# EAGLE design openSX70_EDWIN_V7-9_20191123-TSL237T (EAGLE 9.4.2)
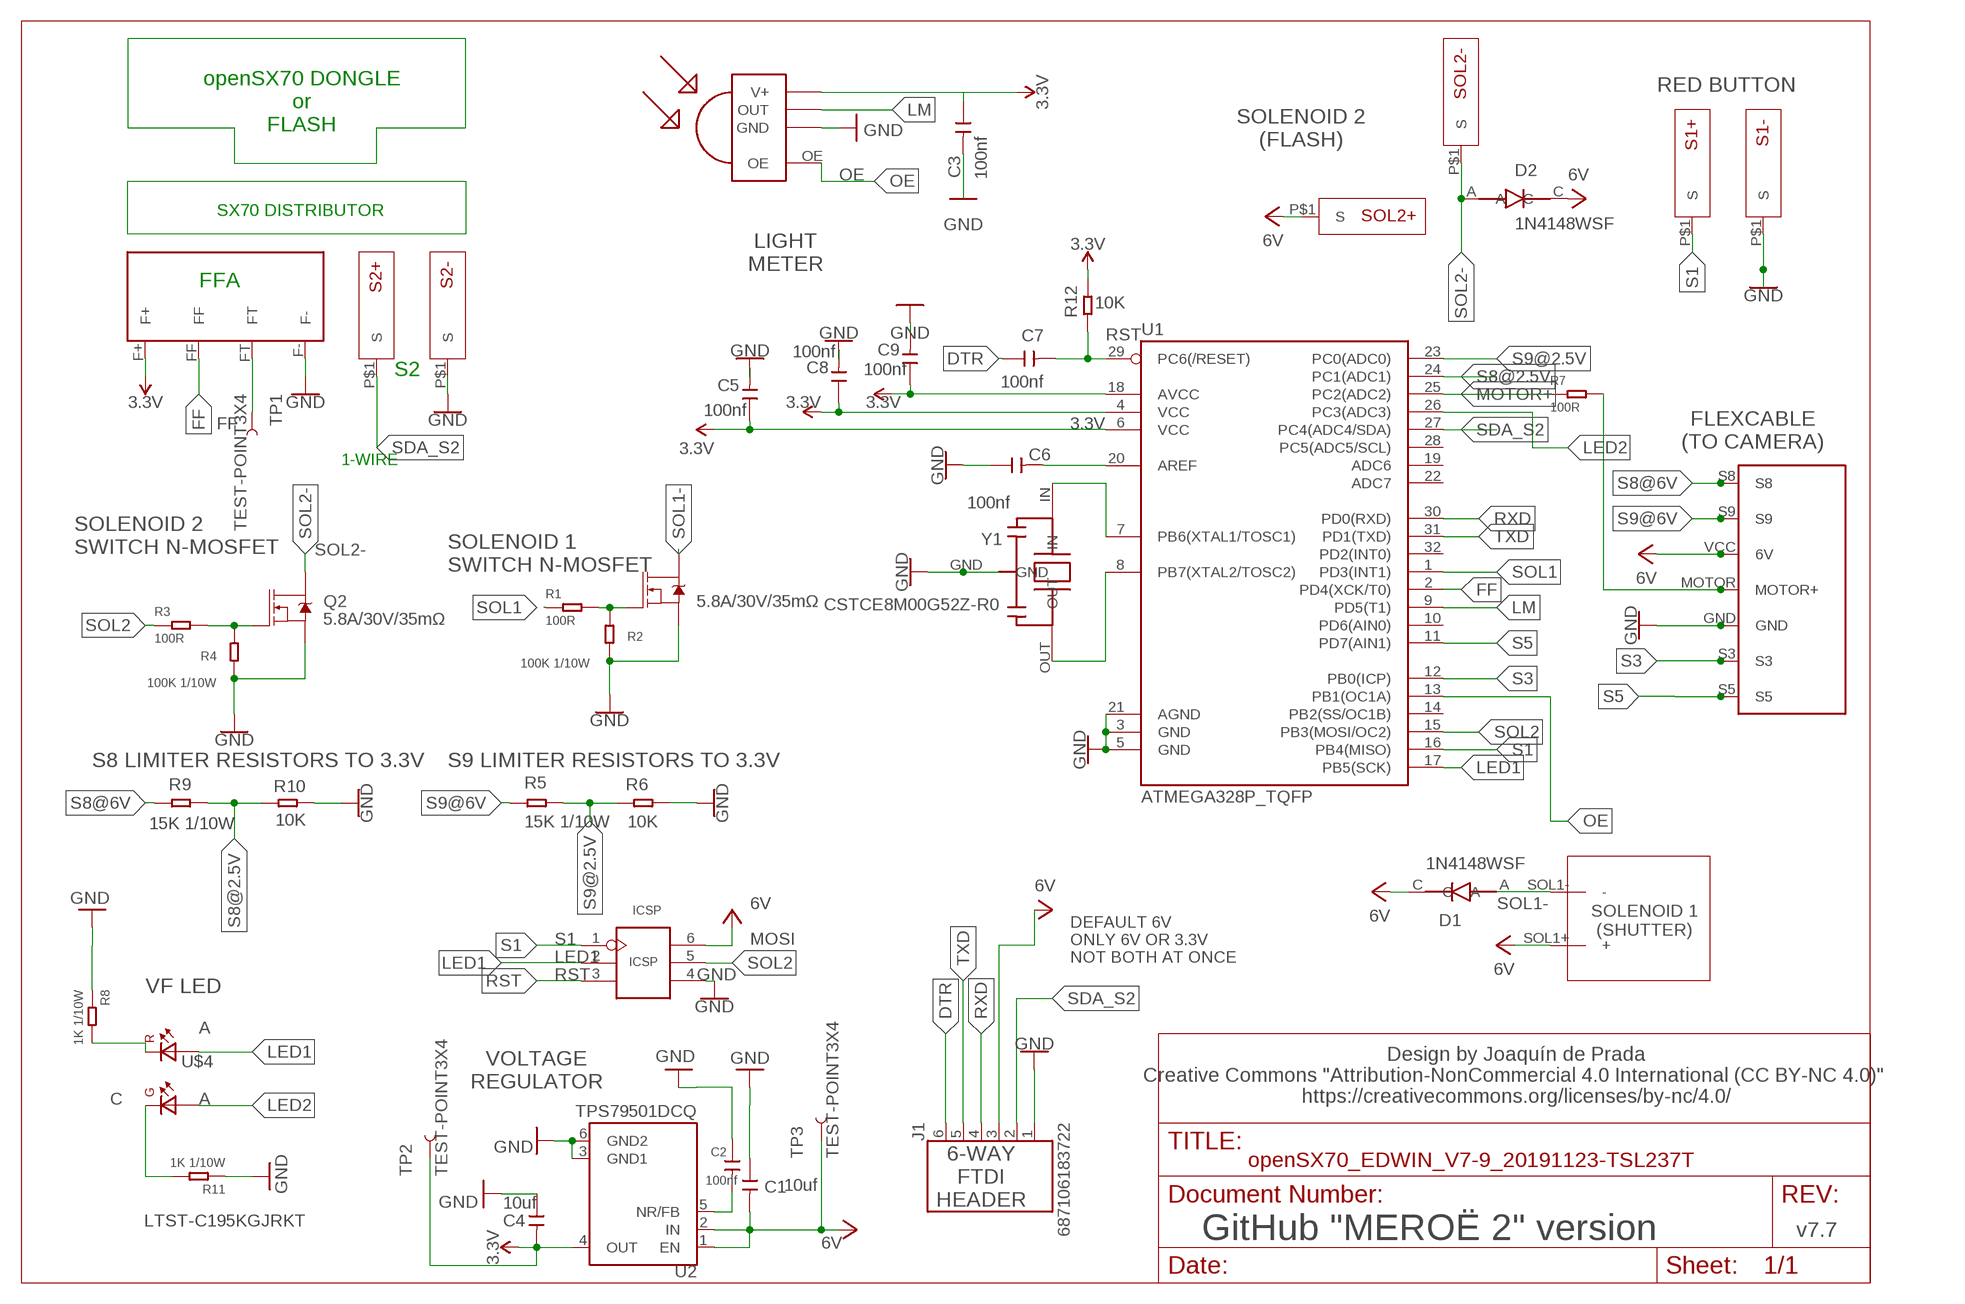
[diagram p0: schematic, sheet 1]

## Parts
C1  10uf  CERAMIC-10UF-10V-10%-X5R(0603)  [C0603]
C2  100nf  CERAMIC-100NF-50V-10%-X7R(0603)  [C0603]
C3  100nf  CERAMIC-100NF-50V-10%-X7R(0603)  [C0603]
C4  10uf  CERAMIC-10UF-10V-10%-X5R(0603)  [C0603]
C5  100nf  CERAMIC-100NF-50V-10%-X7R(0603)  [C0603]
C6  100nf  CERAMIC-100NF-50V-10%-X7R(0603)  [C0603]
C7  100nf  CERAMIC-100NF-50V-10%-X7R(0603)  [C0603]
C8  100nf  CERAMIC-100NF-50V-10%-X7R(0603)  [C0603]
C9  100nf  CERAMIC-100NF-50V-10%-X7R(0603)  [C0603]
D1  1N4148WSF  1N4148WS  [SODFL2512X100N]
D2  1N4148WSF  1N4148WS  [SODFL2512X100N]
ICSP  ICSP  [H2X3-2.54]
J1  687106183722  [687106183722]
Q1  5.8A/30V/35mΩ  MOSFET-NCH-AO3404A  [SOT23-3]
Q2  5.8A/30V/35mΩ  MOSFET-NCH-AO3404A  [SOT23-3]
R1  100R  SMD-RES-100R-5%-1/10W(0603)  [R0603]
R2  100K 1/10W  SMD-RES-100K-5%-1/10W(0603)  [R0603]
R3  100R  SMD-RES-100R-5%-1/10W(0603)  [R0603]
R4  100K 1/10W  SMD-RES-100K-5%-1/10W(0603)  [R0603]
R5  15K 1/10W  SMD-RES-15K-1%-1/10W(0603)  [R0603]
R6  10K  SMD-RES-10K-1%-1/10W(0603)  [R0603]
R7  100R  SMD-RES-100R-5%-1/10W(0603)  [R0603]
R8  1K 1/10W  SMD-RES-1K-5%-1/10W(0603)  [R0603]
R9  15K 1/10W  SMD-RES-15K-1%-1/10W(0603)  [R0603]
R10  10K  SMD-RES-10K-1%-1/10W(0603)  [R0603]
R11  1K 1/10W  SMD-RES-1K-5%-1/10W(0603)  [R0603]
R12  10K  SMD-RES-10K-1%-1/10W(0603)  [R0603]
S1+  SX70-S-PAD-NEW  [SX70-S-PAD2]
S1-  SX70-S-PAD-NEW  [SX70-S-PAD2]
S2+  SX70-S-PAD-NEW  [SX70-S-PAD2]
S2-  SX70-S-PAD-NEW  [SX70-S-PAD2]
SOL1  SX70-SOLENOID1-2PADS  [SX70-SOLENOID1-2]
SOL2+  SX70-S-PAD-NEW  [SX70-S-PAD2]
SOL2-  SX70-S-PAD-NEW  [SX70-S-PAD2]
TP1  TEST-POINT3X4  [PAD.03X.04]
TP2  TEST-POINT3X4  [PAD.03X.04]
TP3  TEST-POINT3X4  [PAD.03X.04]
U1  ATMEGA328P_TQFP  [TQFP32-08]
U2  TPS79501DCQ  [SOT127P706X180-6N]
U$1  SX70-7-PAD  [SX70-7-PAD-PROPER]
U$2  FFA  SX70-FFA-PAD  [FFA-PAD-PACKAGE]
U$3  TSL237T  [TSL237T]
U$4  LTST-C195KGJRKT  [LTST-BILED-15X16]
Y1  CSTCE8M00G52Z-R0  CSTCE16M0V53-R0  [CFP95P160X100-3N]

## Nets
3.3V: C3.1 C4.2 C5.1 C8.1 C9.1 R12.2 TP2.P$1 U1.4(VCC) U1.6(VCC) U1.18(AVCC) U2.4(OUT) U$2.F+ U$3.VDD(V+)
6V: C1.2 D1.C D2.C ICSP.6(VCC) J1.3 SOL1.SOL1+(+) SOL2+.P$1(S) TP3.P$1 U2.1(EN) U2.2(IN) U$1.VCC(6V)
DTR: C7.1 J1.6
FF: U1.2(PD4(XCK/T0)) U$2.FF
GND: C1.1 C2.1 C3.2 C4.1 C5.2 C6.1 C8.2 C9.2 ICSP.4(GND) J1.1 Q1.2(S) Q2.2(S) R2.1 R4.1 R6.2 R8.1 R10.2 R11.1 S1-.P$1(S) S2-.P$1(S) U1.3(GND) U1.5(GND) U1.21(AGND) U2.3(GND1) U2.6(GND2) U$1.GND U$2.F- U$3.GND Y1.GND
LED1: ICSP.2(SCK) U1.17(PB5(SCK)) U$4.P$2(A2)
LED2: U1.26(PC3(ADC3)) U$4.P$1(A1)
LM: U1.9(PD5(T1)) U$3.OUT
MOTOR+: R7.1 U1.25(PC2(ADC2))
MOTOR-HEADER: R7.2 U$1.MOTOR(MOTOR+)
N$1: Q1.1(G) R1.2 R2.2
N$2: C6.2 U1.20(AREF)
N$3: Q2.1(G) R3.2 R4.2
N$4: U1.7(PB6(XTAL1/TOSC1)) Y1.IN
N$5: TP1.P$1 U$2.FT
N$6: U1.8(PB7(XTAL2/TOSC2)) Y1.OUT
N$7: R8.2 U$4.P$4(K2)
N$10: C2.2 U2.5(NR/FB)
N$11: R11.2 U$4.P$3(K1)
OE: U1.13(PB1(OC1A)) U$3.OE
RST: C7.2 ICSP.3(RST) R12.1 U1.29(PC6(/RESET))
RXD: J1.4 U1.30(PD0(RXD))
S1: ICSP.1(MISO) S1+.P$1(S) U1.16(PB4(MISO))
S3: U1.12(PB0(ICP)) U$1.S3
S5: U1.11(PD7(AIN1)) U$1.S5
S8@2.5V: R9.2 R10.1 U1.24(PC1(ADC1))
S8@6V: R9.1 U$1.S8
S9@2.5V: R5.2 R6.1 U1.23(PC0(ADC0))
S9@6V: R5.1 U$1.S9
SDA_S2: J1.2 S2+.P$1(S) U1.27(PC4(ADC4/SDA))
SOL1: R1.1 U1.1(PD3(INT1))
SOL1-: D1.A Q1.3(D) SOL1.SOL1-(-)
SOL2: ICSP.5(MOSI) R3.1 U1.15(PB3(MOSI/OC2))
SOL2-: D2.A Q2.3(D) SOL2-.P$1(S)
TXD: J1.5 U1.31(PD1(TXD))
Unconnected: U1.10(PD6(AIN0)) U1.14(PB2(SS/OC1B)) U1.19(ADC6) U1.22(ADC7) U1.28(PC5(ADC5/SCL)) U1.32(PD2(INT0))

## Notes on the sheet
- RED BUTTON
- openSX70 DONGLE
  or
  FLASH
- SOLENOID 2
  (FLASH)
- SX70 DISTRIBUTOR
- LIGHT
  METER
- FFA
- S2
- FLEXCABLE
  (TO CAMERA)
- 1-WIRE
- SOLENOID 2
  SWITCH N-MOSFET
- SOLENOID 1
  SWITCH N-MOSFET
- S8 LIMITER RESISTORS TO 3.3V | S9 LIMITER RESISTORS TO 3.3V
- SOLENOID 1
  (SHUTTER)
- MOSI
- DEFAULT 6V
  ONLY 6V OR 3.3V
  NOT BOTH AT ONCE
- VF LED
- A
- VOLTAGE
  REGULATOR
- Design by Joaquín de Prada
  Creative Commons "Attribution-NonCommercial 4.0 International (CC BY-NC 4.0)" 
  https://creativecommons.org/licenses/by-nc/4.0/
- C | A
- 6-WAY
  FTDI
  HEADER
- v7.7
- GitHub "MEROË 2" version

## Library data of the parts
C1 C4 = Seeed-Capacitor:CERAMIC-10UF-10V-10%-X5R(0603): 302010103; MPN: CC0603KRX5R6BB106
C2 C3 C5-C9 = Seeed-Capacitor:CERAMIC-100NF-50V-10%-X7R(0603): 302010138; MPN: CC0603KRX7R9BB104
D1 D2 = Common-Parts-Library-Eagle:1N4148WS: 1N4148WS Series 75 V 300 mA Surface Mount Small Signal Diodes - SOD-323F; MANUFACTURER: Fairchild Semiconductor
ICSP = openSX70:ICSP
J1 = 687106183722:687106183722: 687106183722 WR-FPC 0.50mm SMT Horizontal Bottom Contact - Low Profile <http://katalog.we-online.de/media/images/v2/Family_WR-FPC_6871xx183722.jpg> Details see: http://katalog.we-online.de/en/em/FPC_0_5_SMT_ZIF_HORIZONTAL_BOTTOM_CONTACT_LOW_PROFILE_6871xx183722 Created by Yingchun,shan 2016 (C) Wurth Elektronik; AVAILABILITY: Good; DESCRIPTION: CONN FFC BTM 6POS 0.5MM SMD R/A; MF: Wurth Electronics; MP: 687106183722; PACKAGE: None; PRICE: 1.21 USD
Q1 Q2 = openSX70:MOSFET-NCH: N-channel MOSFETs Voltage controlled devices that allow control of high current outputs. SparkFun Products: SparkFun OpenScale <https://www.sparkfun.com/products/13261> SparkFun Digital Sandbox <https://www.sparkfun.com/products/12651> SparkFun Monster Moto Shield <https://www.sparkfun.com/products/10182> SparkFun MOSFET Power Controller <https://www.sparkfun.com/products/11214>; PROD_ID: TRANS-12988
R1 R3 R7 = Seeed-Resistor:SMD-RES-100R-5%-1/10W(0603): 301010090; MPN: RC0603JR-07100RL
R2 R4 = Seeed-Resistor:SMD-RES-100K-5%-1/10W(0603): 301010089; MPN: RC0603JR-07100KL
R5 R9 = Seeed-Resistor:SMD-RES-15K-1%-1/10W(0603): 301010241; MPN: RC0603FR-0715KL
R6 R10 R12 = Seeed-Resistor:SMD-RES-10K-1%-1/10W(0603): 301010299; MPN: RC0603FR-0710KL
R8 R11 = Seeed-Resistor:SMD-RES-1K-5%-1/10W(0603): 301010291; MPN: RC0603JR-071KL
S1+ S1- S2+ S2- SOL2+ SOL2- = openSX70:SX70-S-PAD-NEW
SOL1 = openSX70:SX70-SOLENOID1-2PADS
TP1-TP3 = SparkFun-Connectors:TEST-POINT: SparkFun Test Points Bare copper test points for troubleshooting or In-Circuit-Testing. These are used by our Production team for verifying production board runs using pogo-pins on test beds. SparkFun Products: SparkFun LSM9DS1 Breakout <https://www.sparkfun.com/products/13284> SparkFun PSOC <https://www.sparkfun.com/products/13714> SparkFun Load Cell Amplifier <https://www.sparkfun.com/products/13879>
U1 = openSX70:ATMEGA328P_TQFP: Popular 328P in QFP Storefront component: ATmega328 - TQFP <https://www.sparkfun.com/products/13448> (COM-13448) Datasheet <http://www.sparkfun.com/datasheets/Components/SMD/ATMega328.pdf> SparkFun Products SparkFun RedBoard - Programmed with Arduino <https://www.sparkfun.com/products/12757> (DEV-12757) Arduino Pro Mini 328 - 5V/16MHz <https://www.sparkfun.com/products/11113> (DEV-11113) Arduino Pro Mini 328 - 3.3V/8MHz <https://www.sparkfun.com/products/11114> (DEV-11114) SparkFun OpenLog <https://www.sparkfun.com/products/13712> (DEV-13712) SparkFun MicroView - OLED Arduino Module <https://www.sparkfun.com/products/12923> (DEV-12923) SparkFun Digital Sandbox <https://www.sparkfun.com/products/12651> (DEV-12651) SparkFun PicoBoard <https://www.sparkfun.com/products/11888> (WIG-11888) Arduino Fio <https://www.sparkfun.com/products/10116> (DEV-10116) LilyPad Arduino 328 Main Board <https://www.sparkfun.com/products/13342> (DEV-13342) SparkFun RedStick <https://www.sparkfun.com/products/13741> (DEV-13741) LilyPad MP3 <https://www.sparkfun.com/products/11013> (DEV-11013) LilyPad Arduino SimpleSnap <https://www.sparkfun.com/products/10941> (DEV-10941) SparkFun Stepoko <https://www.sparkfun.com/products/13899> (ROB-13899) SparkFun Geiger Counter <https://www.sparkfun.com/products/11345> (SEN-11345) SparkFun EL Sequencer <https://www.sparkfun.com/products/12781> (COM-12781) Arduino Pro 328 - 5V/16MHz <https://www.sparkfun.com/products/10915> (DEV-10915) CryptoCape <https://www.sparkfun.com/products/12773> (DEV-12773) SparkFun IR Thermometer Evaluation Board - MLX90614 <https://www.sparkfun.com/products/10740> (SEN-10740) SparkFun RedBot Mainboard <https://www.sparkfun.com/products/12097> (ROB-12097) Arduino Pro 328 - 3.3V/8MHz <https://www.sparkfun.com/products/10914> (DEV-10914) SparkFun Block for Intel® Edison - Arduino <https://www.sparkfun.com/products/13036> (DEV-13036) SparkFun Simon Says - Surface Mount Soldering Kit <https://www.sparkfun.com/products/10935> (KIT-10935) SparkFun 7-Segment Serial Display - Red <https://www.sparkfun.com/products/11441> (COM-11441) SparkFun 7-Segment Serial Display - White <https://www.sparkfun.com/products/11629> (COM-11629) SparkFun 7-Segment Serial Display - Yellow <https://www.sparkfun.com/products/11443> (COM-11443) SparkFun 7-Segment Serial Display - Kelly Green <https://www.sparkfun.com/products/11440> (COM-11440) SparkFun 7-Segment Serial Display - Blue <https://www.sparkfun.com/products/11442> (COM-11442) SparkFun OpenSegment Serial Display - 20mm (Blue) <https://www.sparkfun.com/products/11647> (COM-11647) SparkFun OpenSegment Serial Display - 20mm (Green) <https://www.sparkfun.com/products/11646> (COM-11646) SparkFun OpenSegment Serial Display - 20mm (White) <https://www.sparkfun.com/products/11648> (COM-11648) SparkFun OpenSegment Serial Display - 20mm (Red) <https://www.sparkfun.com/products/11644> (COM-11644) SparkFun OpenSegment Serial Display - 20mm (Yellow) <https://www.sparkfun.com/products/11645> (COM-11645) SparkFun OpenSegment Shield <https://www.sparkfun.com/products/13190> (DEV-13190); PROD_ID: IC-09069
U2 = TPS79501DCQ:TPS79501DCQ: Ultralow-Noise, High-PSRR, Fast, RF, 500-mA Low-Dropout Linear Regulators 6-SOT-223 -40 to 125; DESCRIPTION: Ultralow-Noise, High-PSRR, Fast, RF, 500-mA Low-Dropout Linear Regulators 6-SOT-223 -40 to 125; DIGI-KEY_PART_NUMBER: 296-27102-5-ND; DIGI-KEY_PURCHASE_URL: https://www.digikey.com/product-detail/en/texas-instruments/TPS79501DCQ/296-27102-5-ND/1908443?utm_source=snapeda&utm_medium=aggregator&utm_campaign=symbol; MF: Texas Instruments; MP: TPS79501DCQ; PACKAGE: SOT-223-6 Texas Instruments
U$1 = _openSX70:SX70-7-PAD
U$2 = openSX70:SX70-FFA-PAD
U$3 = _openSX70:TSL237T
U$4 = LTST-C195KGJRKT:LTST-C195KGJRKT; AVAILABILITY: Unavailable; DESCRIPTION: Green/Red 130° Water Clear 35/25 mcd 2 V 0605 Surface Mount Bi-Color LED; MF: Lite-On Inc.; MP: LTST-C195KGJRKT; PACKAGE: 0606 Lite-On; PRICE: None
Y1 = CSTCE16M0V53-R0:CSTCE16M0V53-R0: Ceramic Resonator 16MHz ±0.5% (Tol) ±0.3% (Stability) 15pF 40Ohm 3-Pin CSMD T/R; AVAILABILITY: Good; DESCRIPTION: Ceramic Resonator 16MHz ??0.5% (Tol) ??0.3% (Stability) 15pF 40Ohm 3-Pin CSMD T/R; MF: Murata; MP: CSTCE16M0V53-R0; PACKAGE: SMD-3 Murata; PRICE: 0.28 USD

## Net classes
0 default: width 0.254 mm
1 GND: width 0.61 mm

## Board
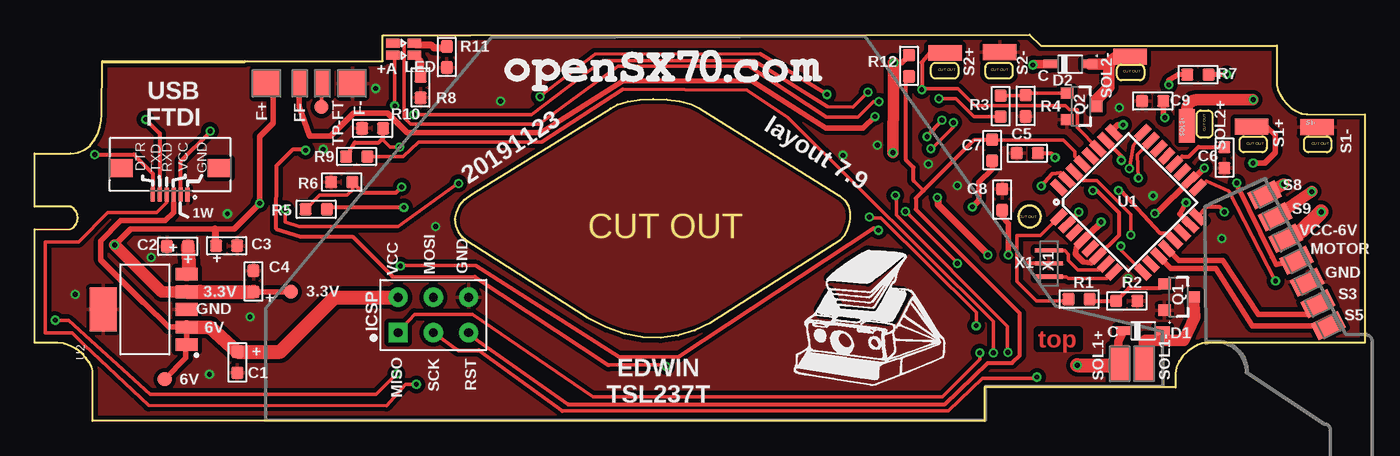
[diagram p1: board, top side]
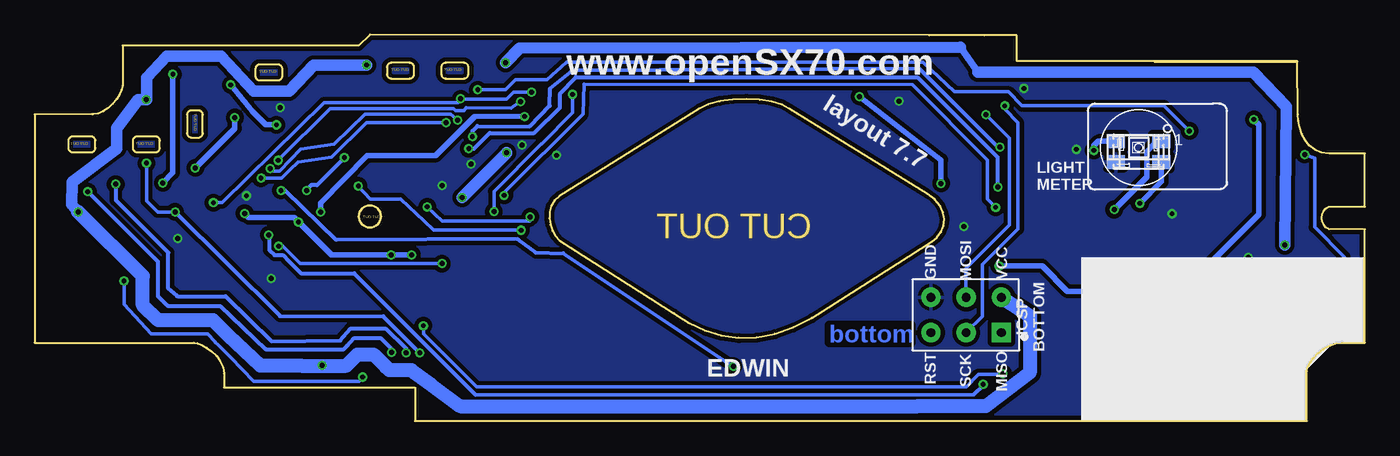
[diagram p2: board, bottom side, seen from below]

Size 95.88 x 27.86 mm. Coordinates in mm from the lower left corner, seen from the top.
Outline: 71.72,15.54 71.88,15.53 72.03,15.48 72.17,15.41 72.29,15.31
Outline: 72.29,15.31 72.39,15.19 72.46,15.06 72.51,14.91 72.52,14.74
Outline: 72.52,14.74 72.51,14.58 72.46,14.43 72.39,14.3 72.29,14.18
Outline: 72.29,14.18 72.17,14.08 72.03,14.01 71.88,13.96 71.72,13.94
Outline: 71.72,13.94 71.56,13.96 71.41,14.01 71.28,14.08 71.16,14.18
Outline: 71.16,14.18 71.06,14.3 70.99,14.43 70.94,14.58 70.92,14.74
Outline: 70.92,14.74 70.94,14.91 70.99,15.06 71.06,15.19 71.16,15.31
Outline: 71.16,15.31 71.28,15.41 71.41,15.48 71.56,15.53 71.72,15.54
Outline: 71.72,15.54 71.57,15.53 71.42,15.48 71.28,15.41 71.16,15.31
Outline: 71.16,15.31 71.06,15.19 70.98,15.05 70.94,14.9 70.92,14.74
Outline: 70.92,14.74 70.94,14.59 70.98,14.44 71.06,14.3 71.16,14.18
Outline: 71.16,14.18 71.28,14.08 71.42,14.01 71.57,13.96 71.72,13.94
Outline: 71.72,13.94 71.88,13.96 72.03,14.01 72.17,14.08 72.29,14.18
Outline: 72.29,14.18 72.39,14.3 72.46,14.44 72.51,14.59 72.52,14.74
Outline: 72.52,14.74 72.51,14.9 72.46,15.05 72.39,15.19 72.29,15.31
Outline: 72.29,15.31 72.17,15.41 72.03,15.48 71.88,15.53 71.72,15.54
Outline: 91.7,22.11 91.77,22.11 95.88,22.11 95.88,5.64 84.4,5.64 84.15,5.6 83.83,5.47 83.48,5.27 83.11,5.01 82.78,4.68 82.5,4.3 82.31,3.87 82.24,3.4 82.24,2.41 68.47,2.41 68.47,0 4.17,0 4.17,3.6 4.11,3.9 3.94,4.23 3.69,4.56 3.36,4.89 2.98,5.18 2.56,5.42 2.11,5.58 1.66,5.64 0,5.64 0,13.82 2.59,13.84 2.81,13.96 2.98,14.15 3.07,14.39 3.1,14.65 3.07,14.91 2.97,15.15 2.81,15.34 2.59,15.45 0,15.46 0,19.29 2.59,19.29 3.14,19.36 3.6,19.56 3.99,19.87 4.3,20.26 4.53,20.7 4.7,21.17 4.79,21.65 4.82,22.11 4.87,25.93 15.15,25.93 15.1,25.94 25.09,25.95 25.09,27.81 27.43,27.82 31.39,27.82 71.71,27.86 72.52,27.07 89.55,27.07 89.55,24.21 89.61,23.9 89.76,23.56 89.97,23.21 90.25,22.87 90.57,22.57 90.93,22.33 91.31,22.17 91.7,22.11
Outline: 83.76,20.77 83.76,22.06 83.77,22.12 83.79,22.19 83.82,22.24 83.86,22.29 83.91,22.33 83.96,22.36 84.03,22.38 84.09,22.39 84.57,22.39 84.64,22.38 84.7,22.36 84.76,22.33 84.81,22.29 84.85,22.24 84.88,22.19 84.9,22.12 84.9,22.06 84.9,20.77 84.9,20.7 84.88,20.64 84.85,20.58 84.81,20.53 84.76,20.49 84.7,20.46 84.64,20.44 84.57,20.44 84.09,20.44 84.03,20.44 83.96,20.46 83.91,20.49 83.86,20.53 83.82,20.58 83.79,20.64 83.77,20.7 83.76,20.77
Outline: 87.19,20.53 88.48,20.53 88.54,20.52 88.61,20.5 88.66,20.47 88.71,20.43 88.75,20.38 88.78,20.32 88.8,20.26 88.81,20.19 88.81,19.71 88.8,19.65 88.78,19.59 88.75,19.53 88.71,19.48 88.66,19.44 88.61,19.41 88.54,19.39 88.48,19.38 87.19,19.38 87.12,19.39 87.06,19.41 87,19.44 86.95,19.48 86.91,19.53 86.88,19.59 86.86,19.65 86.86,19.71 86.86,20.19 86.86,20.26 86.88,20.32 86.91,20.38 86.95,20.43 87,20.47 87.06,20.5 87.12,20.52 87.19,20.53
Outline: 91.84,20.53 93.13,20.53 93.2,20.52 93.26,20.5 93.32,20.47 93.37,20.43 93.41,20.38 93.44,20.32 93.46,20.26 93.46,20.19 93.46,19.71 93.46,19.65 93.44,19.59 93.41,19.53 93.37,19.48 93.32,19.44 93.26,19.41 93.2,19.39 93.13,19.38 91.84,19.38 91.78,19.39 91.71,19.41 91.66,19.44 91.61,19.48 91.57,19.53 91.54,19.59 91.52,19.65 91.51,19.71 91.51,20.19 91.52,20.26 91.54,20.32 91.57,20.38 91.61,20.43 91.66,20.47 91.71,20.5 91.78,20.52 91.84,20.53
Outline: 78.36,25.71 79.65,25.71 79.71,25.7 79.78,25.68 79.83,25.65 79.88,25.61 79.92,25.56 79.95,25.5 79.97,25.44 79.98,25.37 79.98,24.9 79.97,24.83 79.95,24.77 79.92,24.71 79.88,24.66 79.83,24.62 79.78,24.59 79.71,24.57 79.65,24.56 78.36,24.56 78.29,24.57 78.23,24.59 78.17,24.62 78.12,24.66 78.08,24.71 78.05,24.77 78.03,24.83 78.02,24.9 78.02,25.37 78.03,25.44 78.05,25.5 78.08,25.56 78.12,25.61 78.17,25.65 78.23,25.68 78.29,25.7 78.36,25.71
Outline: 68.87,25.84 70.16,25.84 70.23,25.83 70.29,25.81 70.35,25.78 70.39,25.74 70.43,25.69 70.47,25.63 70.49,25.57 70.49,25.51 70.49,25.03 70.49,24.96 70.47,24.9 70.43,24.84 70.39,24.79 70.35,24.75 70.29,24.72 70.23,24.7 70.16,24.69 68.87,24.69 68.8,24.7 68.74,24.72 68.68,24.75 68.64,24.79 68.59,24.84 68.56,24.9 68.54,24.96 68.54,25.03 68.54,25.51 68.54,25.57 68.56,25.63 68.59,25.69 68.64,25.74 68.68,25.78 68.74,25.81 68.8,25.83 68.87,25.84
Outline: 64.95,25.84 66.24,25.84 66.31,25.83 66.37,25.81 66.43,25.78 66.48,25.74 66.52,25.69 66.55,25.63 66.57,25.57 66.57,25.51 66.57,25.03 66.57,24.96 66.55,24.9 66.52,24.84 66.48,24.79 66.43,24.75 66.37,24.72 66.31,24.7 66.24,24.69 64.95,24.69 64.88,24.7 64.82,24.72 64.77,24.75 64.72,24.79 64.68,24.84 64.65,24.9 64.63,24.96 64.62,25.03 64.62,25.51 64.63,25.57 64.65,25.63 64.68,25.69 64.72,25.74 64.77,25.78 64.82,25.81 64.88,25.83 64.95,25.84
Outline: 31.52,16.35 41.5,22.53 42.01,22.82 42.74,23.03 43.62,23.16 44.59,23.21 45.57,23.18 46.5,23.06 47.32,22.84 47.95,22.53 58.05,16.23 58.41,15.9 58.64,15.51 58.76,15.07 58.78,14.61 58.71,14.16 58.56,13.73 58.34,13.34 58.06,13.03 49.78,7.77 48.71,7.05 47.57,6.51 46.38,6.16 45.13,5.99 43.84,6.03 42.53,6.28 41.2,6.75 39.87,7.45 31.22,12.93 30.83,13.23 30.55,13.62 30.37,14.06 30.32,14.55 30.4,15.04 30.62,15.52 30.99,15.97 31.52,16.35
Copper layers (1*16): Top 0.035mm / dielectric 1.5mm / Bottom 0.035mm
Design rules "SeeedStudio_2layer_DRU_no_angle_20140221": minimum track width 6mil, minimum drill 12mil, track to track 6mil, track to pad 6mil, pad to pad 6mil, via to via 6mil, smd to smd 0mil, copper to edge 10mil, drill to drill 10mil, minimum pad ring 10mil, minimum via ring 6mil, stop-mask expansion 2mil, vias tented up to drill 100mil, thermal gap 10mil
tRestrict: area 57.2,10 to 62.6,12.3; area 56.5,7.2 to 62.8,9.4

### Footprints (pad centres in the part's own frame; a part is rotated, then mirrored left to right if it is on the bottom)
C0603 = smd 0.889 x 0.889: 1 0,0.762; 2 0,-0.762
SODFL2512X100N = smd 1.05 x 0.6: A 1.4,0; C -1.4,0
H2X3-2.54 = drill 0.635 pad 1.397 square: 1 -1.27,2.54 | drill 0.635 pad 1.397: 2 -1.27,0; 3 -1.27,-2.54; 4 1.27,-2.54; 5 1.27,0; 6 1.27,2.54
687106183722 = smd 0.3 x 1: 1 -1.25,1.9; 2 -0.75,1.9; 3 -0.25,1.9; 4 0.25,1.9; 5 0.75,1.9; 6 1.25,1.9 | smd 1.65 x 1.3: Z1 -3.525,0; Z2 3.525,0
SOT23-3 = smd 0.8 x 0.9: 1 -0.95,-1; 2 0.95,-1; 3 0,1.1
R0603 = smd 0.889 x 0.889: 1 0,0.762; 2 0,-0.762
SX70-S-PAD2 = smd 2.413 x 1.143: P$1 0.01,0.087
SX70-SOLENOID1-2 = smd 1.372 x 2.54: SOL1+ -0.826,0.127; SOL1- 0.953,0.127
PAD.03X.04 = smd 1.016 x 1.016: P$1 0,0
TQFP32-08 = smd 1.27 x 0.559: 1 -4.293,2.8; 2 -4.293,2; 3 -4.293,1.2; 4 -4.293,0.4; 5 -4.293,-0.4; 6 -4.293,-1.2; 7 -4.293,-2; 8 -4.293,-2.8; 17 4.293,-2.8; 18 4.293,-2; 19 4.293,-1.2; 20 4.293,-0.4; 21 4.293,0.4; 22 4.293,1.2; 23 4.293,2; 24 4.293,2.8 | smd 0.559 x 1.27: 9 -2.8,-4.293; 10 -2,-4.293; 11 -1.2,-4.293; 12 -0.4,-4.293; 13 0.4,-4.293; 14 1.2,-4.293; 15 2,-4.293; 16 2.8,-4.293; 25 2.8,4.293; 26 2,4.293; 27 1.2,4.293; 28 0.4,4.293; 29 -0.4,4.293; 30 -1.2,4.293; 31 -2,4.293; 32 -2.8,4.293
SOT127P706X180-6N = smd 0.92 x 1.61: 1 -2.54,-3.005; 2 -1.27,-3.005; 3 0,-3.005; 4 1.27,-3.005; 5 2.54,-3.005 | smd 3.16 x 1.97: 6 0,3.005
SX70-7-PAD-PROPER = smd 1.31 x 2.159: GND 7.875,1.312; MOTOR 6.125,1.312; S3 9.625,1.312; S5 11.375,1.312; S8 0.875,1.312; S9 2.625,1.312; VCC 4.375,1.312
FFA-PAD-PACKAGE = smd 1.95 x 1.95: F+ -3.277,-0.013; F- 2.87,0 | smd 1.05 x 1.95: FF -0.914,0; FT 0.737,0.025
TSL237T = smd 1.3 x 1: GND -1.597,-1.016; OE -1.597,0.484; OUT 1.703,0.484; VDD 1.703,-1.016
LTST-BILED-15X16 = smd 0.65 x 0.952: P$1 0.425,0.776; P$2 -0.425,0.776; P$3 0.425,-0.776; P$4 -0.425,-0.776
CFP95P160X100-3N = smd 0.3 x 2.032: GND 0.038,0.175; IN -0.912,0.177; OUT 0.992,0.174

### Placement (x,y rotation side)
C1  14.61,4.23 180 top
C2  10.3,12.59 90 top
C3  13.84,12.63 90 top
C4  15.77,10.07 0 top
C5  71.55,19.31 270 top
C6  85.76,18.99 180 top
C7  69.02,19.53 180 top
C8  69.75,15.96 180 top
C9  80.59,23.07 270 top
D1  79.91,6.51 0 top
D2  74.65,25.74 0 top
ICSP  28.74,7.64 90 top
J1  9.77,18.23 180 top
Q1  82.43,8.94 270 top
Q2  75.41,22.69 270 top
R1  75.28,8.78 90 top
R2  78.72,8.66 270 top
R3  69.64,22.71 180 top
R4  71.43,22.73 180 top
R5  20.29,15.26 270 top
R6  22.14,17.23 270 top
R7  83.86,24.98 90 top
R8  27.81,24.06 180 top
R9  23.21,19.07 270 top
R10  24.36,21.1 270 top
R11  29.7,26.26 180 top
R12  63.03,25.61 180 top
S1+  87.72,21.14 0 top
S1-  92.42,21.09 0 top
S2+  65.62,26.46 0 top
S2-  69.56,26.51 0 top
SOL1  79.03,4.05 0 top
SOL2+  83.14,21.28 90 top
SOL2-  78.96,26.19 0 top
TP1  20.67,22.64 0 top
TP2  18.46,9.3 0 top
TP3  9.37,3.01 0 top
U1  78.84,15.77 45 top
U2  7.95,8.03 90 top
U$1  87.1,16.52 296 top
U$2  20.04,24.34 0 top
U$3  16.36,19.69 0 bottom
U$4  26.59,26.8 90 top
Y1  72.94,11.39 270 top

### Tracks (layer width: path | path; a pad name or v marks a point on that pad's centre or on a via)
3.3V  (via drill 0.35)
  Top 0.305: C5.1 73.28,19.31 73.58,19.01 v73.56,18.98 | v76.28,16.62 76.55,16.62 78.15,15.02 78.15,13.39 U1.6 76.16,11.39
  Top 0.406: U1.4 75.08,12.51 75.02,12.04 75.6,11.45 76.16,11.39 | R12.2 62.51,25.85 v61.93,25.85 | C4.2 TP2.P$1 | U$2.F+ 17.19,23.9 17.19,21.5 16.22,20.52 v16.22,15.69 14.38,13.86 13,13.86 6.94,13.86 v5.76,12.68 | v84.3,18.25 83.45,17.39 U1.18 80.87,14.97 v80.75,14.97 | v81.46,21.88 81.36,21.98 C9.1 | v70.18,11.97 70.21,12 70.21,14.23 69.75,14.69 C8.1
  Top 0.508: U1.4 76.84,14.25 v76.87,14.35 | v65.09,16.12 65.11,16.12 65.11,15.6 68.71,12 v68.71,11.97 | 13,13.86 13,12.71
  Top 0.61: 13,12.71 C3.1
  Top 0.813: v61.87,19.35 61.87,19.53 61.87,19.52 61.91,23.74 61.91,25.83 v61.93,25.85 | v5.76,12.68 9.14,9.3 11.91,9.3
  Top 1.016: U2.4 11.91,9.3 C4.2
  Bottom 0.305: v73.56,18.98 75.54,17 75.94,17 76.33,16.62 v76.28,16.62
  Bottom 0.406: v80.75,14.97 80.44,14.66 77.19,14.66 v76.87,14.35 76.85,14.35 74.48,11.97 v70.18,11.97 v68.71,11.97 | v84.3,18.25 81.46,21.09 v81.46,21.88 | U$3.VDD 14.65,17.26 v16.22,15.69
  Bottom 0.508: 29.15,26.94 27.88,25.16
  Bottom 0.813: v5.76,12.68 5.68,22.68 8.02,25.15 27.88,25.16 | v61.93,25.85 60.92,26.87 29.15,26.94 | v65.09,16.12 61.87,19.34 v61.87,19.35
6V  (via drill 0.35)
  Top 0.254: 87.79,23.17 v87.84,23.17 | J1.3 10.02,15.71
  Top 0.406: TP3.P$1 10.9,4.53 10.9,5.49 U2.1 U2.2 9.65,6.76 7.87,8.54 7.84,8.54 4.77,11.61 4.77,12.99 6.21,14.44 9.42,14.44 10.02,15.04 10.02,15.71
  Top 0.61: v71.95,25.68 arc-90 72.01,25.74 D2.C | SOL1.SOL1+ 78.11,5.74 D1.C
  Top 0.813: SOL2+.P$1 83.05,22.42 arc-90 83.79,23.17 87.79,23.17
  Top 1.016: v75.16,4.01 77.95,4.02 SOL1.SOL1+ | 92.72,15.07 v92.75,15.07 | ICSP.6 21.63,8.91 17.7,4.99 C1.2 12.65,6.74 U2.2
  Top 1.067: U$1.VCC 91.31,13.7 92.72,15.07
  Bottom 0.254: v87.84,23.17 87.95,23.17 87.79,23.17
  Bottom 0.813: 86.71,7.26 86.97,7.26 | 76.68,3.98 v75.16,4.01 | v71.95,25.68 75.77,25.68 77.55,23.77 80.1,23.77 82.45,26.31 86.37,26.31 87.82,24.76 87.79,23.17 | v92.75,15.07 93.21,15.6 93.19,17.23 89.95,19.64 89.95,21.13 88.44,23.17 v87.84,23.17
  Bottom 1.016: 86.71,7.26 83.03,7.26 81.89,6.12 79.6,3.98 76.68,3.98 73.42,3.98 72.62,4.78 71.46,4.78 70.56,3.89 70.31,3.65 68.74,3.65 67.35,2.65 65.22,1.06 32.2,1.06 27.32,1.06 24.16,3.48 24.14,7.56 ICSP.6 | 86.97,7.26 88.08,8.34 88.08,10.44 v92.75,15.07
DTR  (via drill 0.35)
  Top 0.254: v26.08,3.4 24.62,1.93 23.65,1.93 8.32,1.92 2.44,7.24 1.49,7.24 v1.47,7.27 | v67.87,6.87 67.87,7.82 60.99,14.64 60.25,14.64 v60.17,14.71
  Top 0.305: v4.33,19.22 7.16,19.22 7.37,19.01 7.37,18.98 8.52,17.83 J1.6
  Top 0.406: C7.1 69.02,18.18 68.06,17.22 68.06,15.91 v67.59,15.44
  Bottom 0.254: v4.33,19.22 3.62,18.98 3.62,13.99 1.47,11.84 v1.47,7.27 | v67.59,15.44 66.53,14.42 60.17,14.44 v60.17,14.71 | v26.08,3.4 26.14,3.35 27.84,3.35 28.71,2.47 64.03,2.47 67.84,6.28 67.84,6.84 v67.87,6.87
FF  (via drill 0.35)
  Top 0.406: U$2.FF 19.07,24.29 19.07,22.68 19.82,20.56 21.33,20.56 22.99,22.21 25.43,22.22 26.86,20.79 36.52,20.79 42.39,24.52 51.66,24.54 57.04,21.13 59.72,21.11 v60.57,21.96 | v75.28,15.07 75.28,15.03 U1.2
  Bottom 0.406: v60.57,21.96 60.58,21.98 64.18,21.94 66.97,19.14 71.92,19.14 75.28,15.73 v75.28,15.07
GND  (via drill 0.35)
  Top 0.305: Y1.GND 71.5,11.36 71.5,11.39
  other vias: 66.52,16.98 85.57,13.17 78.18,22.59 80.62,16.24 28.9,14.03 2.92,9.13 15.52,7.5 8.41,11.79 13.89,14.94 20.8,19.59 60.76,19.9 78.84,10.27 12.6,3.36 33.58,23.07 24.59,23.99 64.41,18.52 58.27,19.16
  pour Top (isolate 0.305): 91.7,22.11 91.77,22.11 95.88,22.11 95.88,5.64 84.4,5.64 84.15,5.6 83.83,5.47 83.48,5.27 83.11,5.01 82.78,4.68 82.5,4.3 82.31,3.87 82.24,3.4 82.24,2.41 68.47,2.41 68.47,0 4.17,0 4.17,3.6 4.11,3.9 3.94,4.23 3.69,4.56 3.36,4.89 2.98,5.18 2.56,5.42 2.11,5.58 1.66,5.64 0,5.64 0,13.82 2.59,13.84 2.81,13.96 2.98,14.15 3.07,14.39 3.1,14.65 3.07,14.91 2.97,15.15 2.81,15.34 2.59,15.45 0,15.46 0,19.29 2.59,19.29 3.14,19.36 3.6,19.56 3.99,19.87 4.3,20.25 4.53,20.7 4.7,21.17 4.79,21.65 4.82,22.11 4.82,25.94 15.1,25.94 25.28,25.89 25.35,27.86 71.71,27.86 72.52,27.07 89.55,27.07 89.55,24.21 89.61,23.9 89.76,23.56 89.97,23.21 90.25,22.87 90.57,22.57 90.93,22.33 91.31,22.17
  pour Bottom (isolate 0.305): 91.7,22.11 91.77,22.11 95.88,22.11 95.88,5.64 84.4,5.64 84.15,5.6 83.83,5.47 83.48,5.27 83.11,5.01 82.78,4.68 82.5,4.3 82.31,3.87 82.24,3.4 82.24,2.41 68.47,2.41 68.47,0 4.17,0 4.17,3.6 4.11,3.9 3.94,4.23 3.69,4.56 3.36,4.89 2.98,5.18 2.56,5.42 2.11,5.58 1.66,5.64 0,5.64 0,13.82 2.59,13.84 2.81,13.96 2.98,14.15 3.07,14.39 3.1,14.65 3.07,14.91 2.97,15.15 2.81,15.34 2.59,15.45 0,15.46 0,19.29 2.59,19.29 3.14,19.36 3.6,19.56 3.99,19.87 4.3,20.25 4.53,20.7 4.7,21.17 4.79,21.65 4.82,22.11 4.82,25.8 14.99,25.8 14.98,25.69 25.31,25.79 25.51,27.86 71.71,27.86 72.52,27.07 89.55,27.07 89.55,24.21 89.61,23.9 89.76,23.56 89.97,23.21 90.25,22.87 90.57,22.57 90.93,22.33 91.31,22.17
LED1  (via drill 0.35)
  Top 0.254: v72.26,3.16 72.17,3.07 68.33,3.07 65.88,0.72 38.05,0.72 | U1.17 84.45,17.29 86.08,16.59 v89.45,10.09 | v25.96,22.73 25.93,22.75 25.93,26.26 U$4.P$2
  Top 0.305: ICSP.2 30.5,5.09 32.03,5.09 38.05,0.72
  Bottom 0.254: v72.26,3.16 72.5,2.87 80.1,2.87 81.76,4.57 82.66,5.47 82.88,5.68 83.41,6.28 87.48,6.28 89.45,8.4 v89.45,10.09 | v25.96,22.73 25.96,22.47 25,21.52 25,13.83 27.56,11.28 27.56,7.55 ICSP.2
LED2  (via drill 0.35)
  Top 0.254: v60.86,23.02 60.45,23.02 59.33,21.9 57.08,21.9 51.49,25.57 42.06,25.57 36.36,21.42 27.09,21.42 26.61,21.89 26.61,27.17 26.55,27.23 U$4.P$1
  Top 0.305: U1.26 78.43,19.01 78.43,18.9 v78.33,18.8
  Bottom 0.254: v78.33,18.8 74.59,22.54 65.69,22.54 65.53,22.38 64.92,22.38 64.77,22.59 61.53,22.57 61.01,22.97 60.91,22.97 v60.86,23.02
LM  (via drill 0.35)
  Top 0.254: U1.9 78.31,12.34 v78.31,12.6 | v66.52,11.35 66.52,11.38 62.81,15.09 v62.78,15.09 | v57.12,23.55 52.29,26.48 40.38,26.47 36.42,23.43 v36.42,23.4 | v18.06,15.25 18.06,14.33 19.05,14.01 26.18,14.03 30.48,17.13 v30.56,17.13
  Bottom 0.254: v78.31,12.6 78,12.6 76.75,11.35 v66.52,11.35 | v57.12,23.55 57.12,22.22 59.36,19.98 59.38,19.95 62.78,16.56 v62.78,15.09 | v36.42,23.4
  Bottom 0.406: v36.42,23.4 30.56,18.82 v30.56,17.13 | U$3.OUT 14.99,20.18 15.72,19.44 15.72,17.59 v18.06,15.25
MOTOR+  (via drill 0.35)
  Top 0.406: U1.25 77.57,20.98 77.7,20.98 78.08,21.36 v78.46,21.36 | v81.75,24.24 81.75,24.56 82.49,25 R7.1
  Bottom 0.406: v78.46,21.36 79.22,21.36 80.17,22.31 v81.75,24.24
MOTOR-HEADER  (via drill 0.35)
  Top 0.406: v86.65,17.17 86.65,17.04 89.23,11.82 89.5,11.28 U$1.MOTOR | v85.92,25.01 R7.2
  Bottom 0.406: v85.92,25.01 85.92,17.9 v86.65,17.17
N$1
  Top 0.254: R1.2 76.11,8.72 76.3,8.72 76.36,8.66
  Top 0.305: 76.36,8.66 R2.2 78.86,9.56 81.11,9.56 Q1.1
N$2
  Top 0.305: U1.20 82.72,19.08 83.21,19.08 83.88,19.76 C6.2
N$3
  Top 0.254: Q2.1 71.58,23.64 R4.2 71.41,23.47 R3.2
N$4
  Top 0.254: U1.7 77.17,11.32 76.74,10.89 75.2,10.89 74.52,11.56 74.52,11.89 74.51,11.9 74.52,11.98 74.52,12.02 74.25,12.3 Y1.IN
N$5
  Top 0.254: U$2.FT 20.67,24.27 TP1.P$1
N$6
  Top 0.254: U1.8 77.29,10.26 74.52,10.26 74.38,10.4 Y1.OUT
N$7
  Top 0.508: U$4.P$4 27.81,25.94 R8.2
N$10
  Top 1.016: U2.5 11.16,10.78 C2.2
N$11
  Top 0.254: U$4.P$3 27.46,27.14 | 29.54,26.91 R11.2
  Top 0.508: 29.54,26.91 28.78,26.91 28.55,27.14 27.46,27.14
N$17
  pour Top: 31.52,16.35 41.5,22.53 42.01,22.82 42.74,23.03 43.62,23.16 44.59,23.21 45.57,23.18 46.5,23.05 47.32,22.84 47.96,22.53 58.05,16.23 58.41,15.9 58.64,15.51 58.77,15.07 58.78,14.61 58.71,14.16 58.56,13.73 58.34,13.34 58.06,13.03 49.78,7.76 48.71,7.05 47.57,6.51 46.38,6.16 45.13,5.99 43.85,6.03 42.53,6.28 41.2,6.75 39.87,7.45 31.22,12.93 30.83,13.23 30.55,13.62 30.37,14.06 30.32,14.55 30.4,15.04 30.62,15.52 30.99,15.97
N$19
  pour Bottom: 83.76,20.77 83.76,22.06 83.77,22.12 83.79,22.19 83.82,22.24 83.86,22.29 83.91,22.33 83.96,22.36 84.03,22.38 84.09,22.39 84.57,22.39 84.64,22.38 84.7,22.36 84.76,22.33 84.81,22.29 84.85,22.24 84.88,22.19 84.9,22.12 84.9,22.06 84.9,20.77 84.9,20.7 84.88,20.64 84.85,20.58 84.81,20.53 84.76,20.49 84.7,20.46 84.64,20.44 84.57,20.44 84.09,20.44 84.03,20.44 83.96,20.46 83.91,20.49 83.86,20.53 83.82,20.58 83.79,20.64 83.77,20.7
N$20
  pour Bottom: 87.19,20.53 88.48,20.53 88.54,20.52 88.61,20.5 88.66,20.47 88.71,20.43 88.75,20.38 88.78,20.32 88.8,20.26 88.81,20.19 88.81,19.71 88.8,19.65 88.78,19.59 88.75,19.53 88.71,19.48 88.66,19.44 88.61,19.41 88.54,19.39 88.48,19.38 87.19,19.38 87.12,19.39 87.06,19.41 87,19.44 86.95,19.48 86.91,19.53 86.88,19.59 86.86,19.65 86.86,19.71 86.86,20.19 86.86,20.26 86.88,20.32 86.91,20.38 86.95,20.43 87,20.47 87.06,20.5 87.12,20.52
N$21
  pour Bottom: 91.84,20.53 93.13,20.53 93.2,20.52 93.26,20.5 93.32,20.47 93.37,20.43 93.41,20.38 93.44,20.32 93.46,20.26 93.46,20.19 93.46,19.71 93.46,19.65 93.44,19.59 93.41,19.53 93.37,19.48 93.32,19.44 93.26,19.41 93.2,19.39 93.13,19.38 91.84,19.38 91.78,19.39 91.71,19.41 91.66,19.44 91.61,19.48 91.57,19.53 91.54,19.59 91.52,19.65 91.51,19.71 91.51,20.19 91.52,20.26 91.54,20.32 91.57,20.38 91.61,20.43 91.66,20.47 91.71,20.5 91.78,20.52
N$22
  pour Bottom: 78.36,25.71 79.65,25.71 79.71,25.7 79.78,25.68 79.83,25.65 79.88,25.61 79.92,25.56 79.95,25.5 79.97,25.44 79.98,25.37 79.98,24.9 79.97,24.83 79.95,24.77 79.92,24.71 79.88,24.66 79.83,24.62 79.78,24.59 79.71,24.57 79.65,24.56 78.36,24.56 78.29,24.57 78.23,24.59 78.17,24.62 78.12,24.66 78.08,24.71 78.05,24.77 78.03,24.83 78.02,24.9 78.02,25.37 78.03,25.44 78.05,25.5 78.08,25.56 78.12,25.61 78.17,25.65 78.23,25.68 78.29,25.7
N$23
  pour Bottom: 68.87,25.84 70.16,25.84 70.23,25.83 70.29,25.81 70.35,25.78 70.39,25.74 70.44,25.69 70.47,25.63 70.49,25.57 70.49,25.5 70.49,25.03 70.49,24.96 70.47,24.9 70.44,24.84 70.39,24.79 70.35,24.75 70.29,24.72 70.23,24.7 70.16,24.69 68.87,24.69 68.8,24.7 68.74,24.72 68.69,24.75 68.64,24.79 68.6,24.84 68.56,24.9 68.55,24.96 68.54,25.03 68.54,25.5 68.55,25.57 68.56,25.63 68.6,25.69 68.64,25.74 68.69,25.78 68.74,25.81 68.8,25.83
N$24
  pour Bottom: 64.95,25.84 66.24,25.84 66.31,25.83 66.37,25.81 66.43,25.78 66.48,25.74 66.52,25.69 66.55,25.63 66.57,25.57 66.57,25.5 66.57,25.03 66.57,24.96 66.55,24.9 66.52,24.84 66.48,24.79 66.43,24.75 66.37,24.72 66.31,24.7 66.24,24.69 64.95,24.69 64.89,24.7 64.82,24.72 64.77,24.75 64.72,24.79 64.68,24.84 64.65,24.9 64.63,24.96 64.62,25.03 64.62,25.5 64.63,25.57 64.65,25.63 64.68,25.69 64.72,25.74 64.77,25.78 64.82,25.81 64.89,25.83
N$25
  pour Bottom: 31.52,16.35 41.5,22.53 42.01,22.82 42.74,23.03 43.62,23.16 44.59,23.21 45.57,23.18 46.5,23.05 47.32,22.84 47.96,22.53 58.05,16.23 58.41,15.9 58.64,15.51 58.77,15.07 58.78,14.61 58.71,14.16 58.56,13.73 58.34,13.34 58.06,13.03 49.78,7.76 48.71,7.05 47.57,6.51 46.38,6.16 45.13,5.99 43.85,6.03 42.53,6.28 41.2,6.75 39.87,7.45 31.22,12.93 30.83,13.23 30.55,13.62 30.37,14.06 30.32,14.55 30.4,15.04 30.62,15.52 30.99,15.97
OE  (via drill 0.35)
  Top 0.305: U1.13 81.65,13.52 81.15,13.52 78.29,16.62 v78.13,16.62 | v45.52,3.95 45.48,4.04 41.38,4.02 31.72,10.4 25.78,10.42 22.91,13.29 19.17,13.3 17.42,13.85 17.43,18.4 18.59,19.57 19.48,19.57 v19.53,19.52
  Bottom 0.305: v78.13,16.62 77.84,16.62 74.14,13.07 61.06,13.11 59.74,12.14 57.76,12.09 45.53,3.94 v45.52,3.95
  Bottom 0.406: U$3.OE 19.2,20.18 19.53,19.85 v19.53,19.52
RST
  Top 0.254: 64.07,16.61 63.35,17.33 | C7.2 69.06,20.25 74.17,20.25 74.99,19.43 74.99,19.05 U1.29
  Top 0.305: ICSP.3 31.68,5.97 38.43,1.21 65.63,1.2 68.69,4.18 70.46,4.18 71.01,4.73 71.01,7.76 63.52,15.25 63.52,16.06 64.07,16.61 67.75,20.29 C7.2 | 63.35,17.33 63.35,18.29 62.82,18.82 62.82,24.64 R12.1
RXD  (via drill 0.35)
  Top 0.254: v79.01,13.41 79.01,14.87 76.56,17.32 75.59,17.32 U1.30 | v27.51,2.63 26.74,2.63 25.36,1.1 8.22,1.11 3.55,5.47 2.69,6.33 0.76,6.33 0.76,12.91 3.17,12.91 5.28,15.02 8.78,15.02 9.52,15.76 9.52,15.77 J1.4
  Bottom 0.305: v79.01,13.41 78.98,13.39 78.98,12.34 78.6,11.95 77.99,11.95 77.56,11.53 76.69,10.64 72.85,10.64 64.1,1.9 28.19,1.9 27.51,2.58 v27.51,2.63
S1  (via drill 0.35)
  Top 0.254: ICSP.1 27.37,7.68 31.56,7.68 40.24,1.74 65.43,1.74 68.12,4.43 v68.12,4.91
  Top 0.305: U1.16 84.49,15.45 85.38,15.45 v85.76,15.07
  Top 0.406: v87.83,18.59 88.66,18.59 89.43,19.36 89.43,20.6 88.8,21.23 S1+.P$1
  Bottom 0.254: v85.76,15.07 87.03,15.07 87.83,15.86 v87.83,18.59
  Bottom 0.305: v85.76,15.07 78.19,7.57 70.76,7.55 v68.12,4.91
S3
  Top 0.406: U1.12 82.47,11.58 85.65,11.58 88.21,7.69 91.74,7.69 U$1.S3
S5
  Top 0.254: U1.11 81.05,11.89
  Top 0.406: 81.05,11.89 81.89,10.98 85.16,10.98 87.77,6.87 U$1.S5
S8@2.5V  (via drill 0.35)
  Top 0.254: U1.24 79.18,19.86 v78.92,18.2 | 25.13,20.9 R10.1 25.12,20.24 25.61,19.75 v26.31,19.75
  Top 0.305: R9.2 23.06,20.09 24.8,20.09 25.13,20.42 25.13,20.9 | v64.33,20.5 v65.4,21.7
  Bottom 0.254: v78.92,18.2 78.74,18.02 78.22,18.02 76.73,19.6 74.28,19.98 72.08,22.13 65.91,22.13 65.46,21.75 v65.4,21.7 | v26.31,19.75 26.45,19.75
  Bottom 0.305: 26.45,19.75 32.14,25.43 57.12,25.28 58.73,23.98 58.76,22.72 60.22,21.24 63.97,21.27 64.33,20.91 v64.33,20.5
S8@6V  (via drill 0.35)
  Top 0.254: v69.1,4.91 69.1,7.18 54.32,21.87 51.35,23.87 42.4,23.92 36.55,20.1 27.68,20.1 26.56,19.06 R9.1
  Top 0.813: v90.04,17.08 U$1.S8
  Bottom 0.305: v90.04,17.08 90.04,15.92 86.26,12.14 86.26,9.55 85.63,9 85.59,8.98 82.12,8.98 78.81,5.74 73.85,5.8 73.11,6.67 70.69,6.67 70.59,6.66 69.1,5.22 v69.1,4.91
S9@2.5V  (via drill 0.35)
  Top 0.254: R5.2 20.55,16.28 22.52,16.28 22.9,16.66 22.9,17.17 | v79.57,17.51 79.5,19.21 U1.23 | v64.59,19.64 64.67,19.64 66.22,21.19 v66.22,21.52
  Top 0.305: v26.46,16.88 26.03,16.45 23.68,16.45 R6.1 22.9,17.17
  Bottom 0.254: v79.57,17.51 78.1,17.51 77.47,18.13 76.91,18.67 74.46,19.03 71.97,21.52 v66.21,21.52 v66.22,21.52
  Bottom 0.305: v26.46,16.88 26.46,18.98 32.26,24.78 56.87,24.81 58,23.61 58.02,22.6 59.88,20.77 63.08,20.78 64.21,19.64 v64.59,19.64
S9@6V  (via drill 0.35)
  Top 0.254: v62.04,16.27 62.12,16.19 62.12,14.84 70.11,6.82 70.11,4.94 v70.16,4.94
  Top 0.305: v26.61,15.41 21.2,15.41 R5.1
  Top 0.813: v92.05,16.53 U$1.S9
  Bottom 0.254: v26.61,15.41 27.19,15.99 27.19,18.83 32.62,24.25 56.28,24.29 56.36,22.15 62.04,16.47 v62.04,16.27
  Bottom 0.305: v92.05,16.53 87,11.48 87,9.01 86.29,8.3 86.23,8.28 82.52,8.28 79.22,5.16 73.6,5.16 73.37,5.42 72.85,5.98 70.96,5.98 70.16,5.18 v70.16,4.94
SDA_S2  (via drill 0.35)
  Top 0.254: v63.94,23.88 64.02,23.96 66.55,23.96 67.77,22.74 74.29,22.74 74.57,22.46 75.16,22.46 75.16,21.15 U1.27
  Top 0.305: S2+.P$1 64.54,26.55 63.94,25.87 v63.94,23.88 | J1.2 10.52,18.73 12.6,20.81 12.65,20.81 v12.65,20.91
  Bottom 0.254: v63.94,23.88 61.94,23.88 61.21,24.62 58.96,24.62 57.56,25.88 31.86,25.88 29.57,23.74 25.71,23.74 24.71,22.74 14.48,22.74 v12.65,20.91
SOL1
  Top 0.254: U1.1 72.48,13.37 70.79,13.36 70.79,10.07 72.21,8.65 74.3,8.65
  Top 0.305: 74.3,8.65 R1.1
SOL1-
  Top 0.254: 81.99,5.82 D1.A
  Top 0.813: Q1.3 83.62,7.51 82.84,5.82 81.99,5.82 80.06,5.82 79.98,5.79 SOL1.SOL1-
SOL2  (via drill 0.35)
  Top 0.254: v27.32,22.1 35.83,22.08 40.95,25.98 51.84,25.99 57.13,22.67 59,22.65 v60.06,23.71 | v65.18,23.24 66.41,23.24 67.7,21.95 R3.1
  Top 0.406: v83,15.74 82.56,14.91 U1.15
  Bottom 0.254: v83,15.74 82.38,15.74 75.03,22.95 65.38,22.96 65.18,23.16 v65.18,23.24 65.15,23.21 61.86,23.21 61.37,23.71 60.04,23.71 v60.06,23.71 | ICSP.5 28.74,11.01 25.62,14.12 25.62,20.41 v27.32,22.1
SOL2-
  Top 0.813: SOL2-.P$1 78.23,26.27 arc90 77.44,25.48 | 77.44,25.48 77.44,24.09 76.51,23.16 Q2.3 | D2.A 77.44,25.74 77.44,25.48
TXD  (via drill 0.35)
  Top 0.254: v26.36,11.18 26.4,11.22 31.78,11.21 42.14,4.62 46.42,4.63 60.48,13.93 60.65,13.93 v60.83,13.75 | U1.31 74.3,17.45 74.24,17.48
  Top 0.305: 74.24,17.48 73.95,17.9 73.36,17.83 v72.55,16.94 | v8,21.75 9.02,20.73 J1.5
  Bottom 0.254: v72.55,16.94 71.7,16.01 69.52,16.01 67.82,14.4 67.14,13.76 63.35,13.76 60.84,13.76 v60.83,13.75
  Bottom 0.406: v8,21.75 7.63,21.38 7.63,14.9 13.18,9.36 21.43,9.36 23.26,11.18 v26.36,11.18

### Text on the board
Top: top
Bottom: bottom
Dimension: CUT OUT | CUT OUT | CUT OUT | CUT OUT | CUT OUT | CUT OUT | CUT OUT | CUT OUT
tPlace: S2+ | S2- | C | USB / FTDI | F+ | FF | F- | SOL2- | 20191123 | Q2 | layout 7.9 | TP-FT | S1+ | SOL2+ | S1- | DTR | TXD | RXD | VCC | GND | U1 | S8 | S9 | 1W | VCC-6V | MOTOR | X1 | X1 | 3.3V | VCC | MOSI | GND | GND | 3.3V | S3 | GND | Q1 | S5 | 6V | C | MISO | SCK | RST | EDWIN / TSL237T | SOL1+ | SOL1- | 6V
bPlace: www.openSX70.com | layout 7.7 | 1 | LIGHT / METER | VCC | MOSI | GND | ICSP / BOTTOM | MISO | SCK | RST | EDWIN
tNames: A+ | LED | + | + | + | + | +
tDocu: Creative Commons "Attribution-NonCommercial 4.0 International (CC BY-NC 4.0)" / https://creativecommons.org/licenses/by-nc/4.0/ | ALL VIAS TENTED | 0.6mm width PCB | FLAT / CABLE | openSX70 project visit www.openSX70.com / version 7.8 "EDWIN TSL237T" 20191123 / IMPORTANT: 0.6mm width PCB!!!! / SILKSCREEN AND REGISTRATION IS SPECIALLY IMPORTANT! / / by Joaquín de Prada